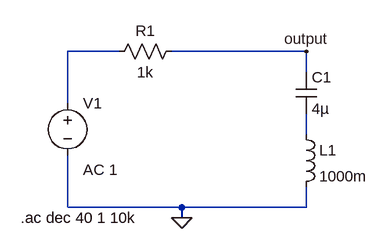
[diagram p0: schematic BandStop.asc]
BandStop.asc, the LTspice schematic file:
Version 4
SHEET 1 880 680
WIRE 288 224 208 224
WIRE 576 224 368 224
WIRE 576 256 576 224
WIRE 208 304 208 224
WIRE 576 352 576 320
WIRE 208 464 208 384
WIRE 384 464 208 464
WIRE 576 464 576 432
WIRE 576 464 384 464
WIRE 384 480 384 464
FLAG 384 480 0
FLAG 576 224 output
SYMBOL cap 560 256 R0
SYMATTR InstName C1
SYMATTR Value 4µ
SYMBOL res 384 208 R90
WINDOW 0 0 56 VBottom 2
WINDOW 3 32 56 VTop 2
SYMATTR InstName R1
SYMATTR Value 1k
SYMBOL ind 560 336 R0
SYMATTR InstName L1
SYMATTR Value 1000m
SYMBOL voltage 208 288 R0
WINDOW 123 24 118 Left 2
SYMATTR Value2 AC 1
SYMATTR InstName V1
SYMATTR Value ""
TEXT 136 480 Left 2 !.ac dec 40 1 10k

The netlist it stands for:
* BandStop.asc
C1 output N002 4µ
R1 output N001 1k
L1 N002 0 1000m
V1 N001 0 AC 1
.ac dec 40 1 10k
.backanno
.end